# EAGLE schematic THT (EAGLE 7.6.0)
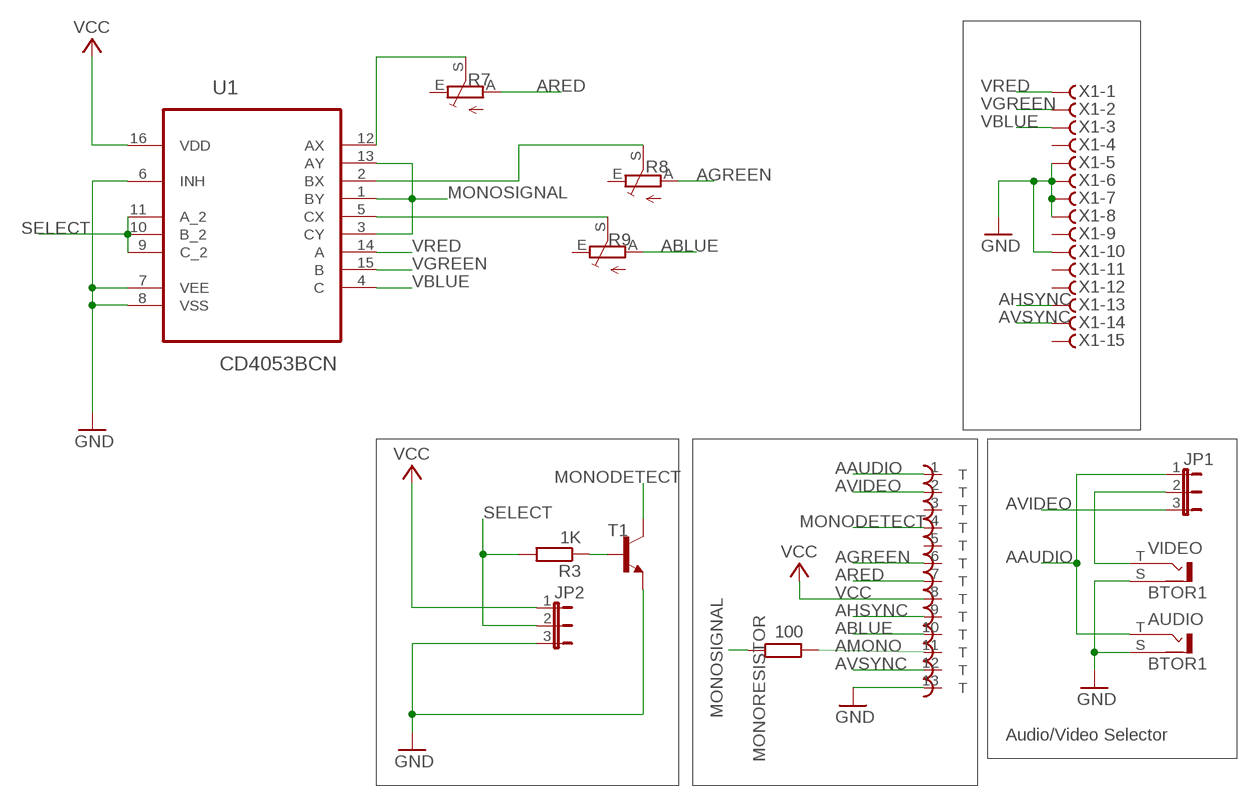
[diagram p0: schematic, sheet 1]

## Parts
ATARIOUT  DIN13T  [ADADS]
AUDIO  BTOR1  [BTOR1]
JP1  JP2E  [JP2]
JP2  JP2E  [JP2]
MONORESISTOR  100  R-EU_0207/2V  [0207/2V]
R3  1K  R-EU_0207/2V  [0207/2V]
R7  TRIM_EU-CA6H  [CA6H]
R8  TRIM_EU-CA6H  [CA6H]
R9  TRIM_EU-CA6H  [CA6H]
T1  2N3904-NPN-TO92-EBC  [TO92-EBC]
U1  CD4053BCN  [DIP254P762X508-16]
VIDEO  BTOR1  [BTOR1]
X1  F15HDVS  [HDF15V]

## Nets
AAUDIO: ATARIOUT.1 AUDIO.T JP1.1
ABLUE: ATARIOUT.10 R9.A
AGREEN: ATARIOUT.6 R8.A
AHSYNC: ATARIOUT.9 X1.13
AMONO: ATARIOUT.11 MONORESISTOR.2
ARED: ATARIOUT.7 R7.A
AVIDEO: ATARIOUT.2 JP1.3
AVSYNC: ATARIOUT.12 X1.14
GND: ATARIOUT.13 AUDIO.S JP2.3 T1.E U1.6(INH) U1.7(VEE) U1.8(VSS) VIDEO.S X1.5 X1.6 X1.7 X1.8 X1.10
MONODETECT: ATARIOUT.4 T1.C
MONOSIGNAL: MONORESISTOR.1 U1.1(BY) U1.3(CY) U1.13(AY)
N$1: R8.S U1.2(BX)
N$2: R9.S U1.5(CX)
N$3: JP1.2 VIDEO.T
N$7: R3.1 T1.B
N$9: R7.S U1.12(AX)
SELECT: JP2.2 R3.2 U1.9(C_2) U1.10(B_2) U1.11(A_2)
VBLUE: U1.4(C) X1.3
VCC: ATARIOUT.8 JP2.1 U1.16(VDD)
VGREEN: U1.15(B) X1.2
VRED: U1.14(A) X1.1
Unconnected: ATARIOUT.3 ATARIOUT.5 AUDIO.S@1 AUDIO.S@2 AUDIO.S@3 R7.E R8.E R9.E VIDEO.S@1 VIDEO.S@2 VIDEO.S@3 X1.4 X1.9 X1.11 X1.12 X1.15

## Notes on the sheet
- Audio/Video Selector

## Library data of the parts
ATARIOUT = ube:DIN13
AUDIO VIDEO = con-lumberg:BTOR1: RCA connectors according to JEITA RC-5231 Cinch RCA-Einbaukupplung nach JEITA RC-5231, stehende Ausführung Source: http://www.lumberg.de/Produkte/PDFs/BTOR1.pdf; OC_FARNELL: 1217030; OC_NEWARK: unknown
JP1 JP2 = jumper:JP2E: JUMPER
MONORESISTOR R3 = rcl:R-EU_: RESISTOR, European symbol
R7-R9 = pot:TRIM_EU-: POTENTIOMETER
T1 = transistor-neu-to92:*-NPN-: NPN Transistror
U1 = Fairchild_By_element14_Batch_1:CD4053BCN: Analog Multiplexer/Demultiplexer; MPN: CD4053BCN; OC_FARNELL: 1014042; OC_NEWARK: 58K8795; PACKAGE: PDIP-16; SUPPLIER: Fairchild
X1 = con-subd:F15?S: SUB-D; OC_FARNELL: unknown; OC_NEWARK: unknown

## Net classes
0 default: width 0.254 mm